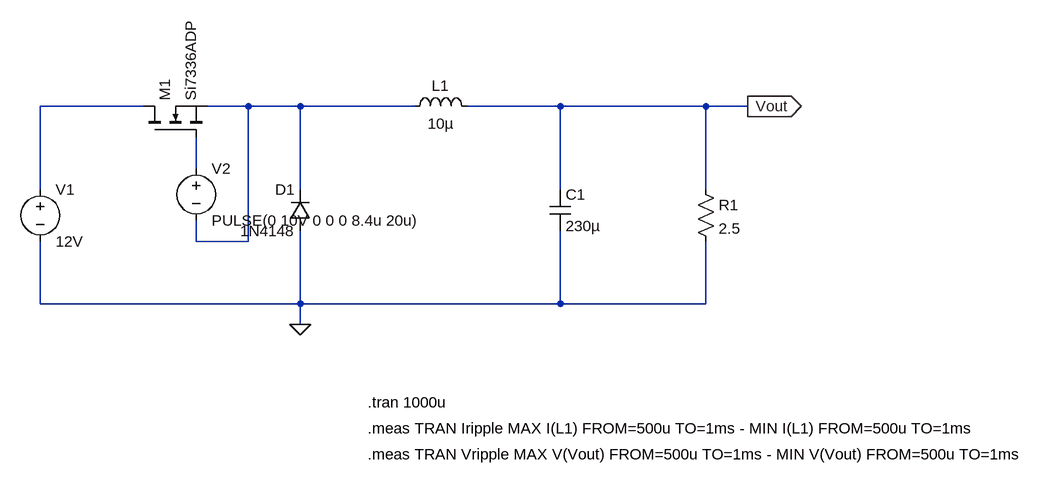
[diagram p0: schematic OPEN LOOP BUCK CONVERTER.asc]
OPEN LOOP BUCK CONVERTER.asc, the LTspice schematic file:
Version 4
SHEET 1 1592 680
WIRE 176 32 16 32
WIRE 336 32 272 32
WIRE 416 32 336 32
WIRE 592 32 416 32
WIRE 816 32 672 32
WIRE 1040 32 816 32
WIRE 1104 32 1040 32
WIRE 256 128 256 80
WIRE 16 160 16 32
WIRE 416 160 416 32
WIRE 816 160 816 32
WIRE 1040 160 1040 32
WIRE 256 240 256 208
WIRE 336 240 336 32
WIRE 336 240 256 240
WIRE 16 336 16 240
WIRE 416 336 416 224
WIRE 416 336 16 336
WIRE 816 336 816 224
WIRE 816 336 416 336
WIRE 1040 336 1040 240
WIRE 1040 336 816 336
WIRE 416 368 416 336
FLAG 416 368 0
FLAG 1104 32 Vout
IOPIN 1104 32 Out
SYMBOL voltage 16 144 R0
SYMATTR InstName V1
SYMATTR Value 12V
SYMBOL diode 432 224 R180
WINDOW 0 24 64 Left 2
WINDOW 3 24 0 Left 2
SYMATTR InstName D1
SYMATTR Value 1N4148
SYMBOL ind 576 48 R270
WINDOW 0 32 56 VTop 2
WINDOW 3 5 56 VBottom 2
SYMATTR InstName L1
SYMATTR Value 10µ
SYMBOL cap 800 160 R0
SYMATTR InstName C1
SYMATTR Value 230µ
SYMBOL res 1024 144 R0
SYMATTR InstName R1
SYMATTR Value 2.5
SYMBOL nmos 176 80 R270
SYMATTR InstName M1
SYMATTR Value Si7336ADP
SYMBOL voltage 256 112 R0
WINDOW 123 0 0 Left 0
WINDOW 39 0 0 Left 0
SYMATTR InstName V2
SYMATTR Value PULSE(0 10V 0 0 0 8.4u 20u)
TEXT 520 488 Left 2 !.tran 1000u
TEXT 520 528 Left 2 !.meas TRAN Iripple MAX I(L1) FROM=500u TO=1ms - MIN I(L1) FROM=500u TO=1ms
TEXT 520 568 Left 2 !.meas TRAN Vripple MAX V(Vout) FROM=500u TO=1ms - MIN V(Vout) FROM=500u TO=1ms

The netlist it stands for:
* OPEN LOOP BUCK CONVERTER.asc
V1 N001 0 12V
D1 0 N002 1N4148
L1 N002 Vout 10µ
C1 Vout 0 230µ
R1 Vout 0 2.5
M1 N001 N003 N002 N002 Si7336ADP
V2 N003 N002 PULSE(0 10V 0 0 0 8.4u 20u)
.model D D
.lib standard.dio
.model NMOS NMOS
.model PMOS PMOS
.lib standard.mos
.tran 1000u
.meas TRAN Iripple MAX I(L1) FROM=500u TO=1ms - MIN I(L1) FROM=500u TO=1ms
.meas TRAN Vripple MAX V(Vout) FROM=500u TO=1ms - MIN V(Vout) FROM=500u TO=1ms
.backanno
.end